# EAGLE design FubarinoMini_v20 (EAGLE 9.1.3)
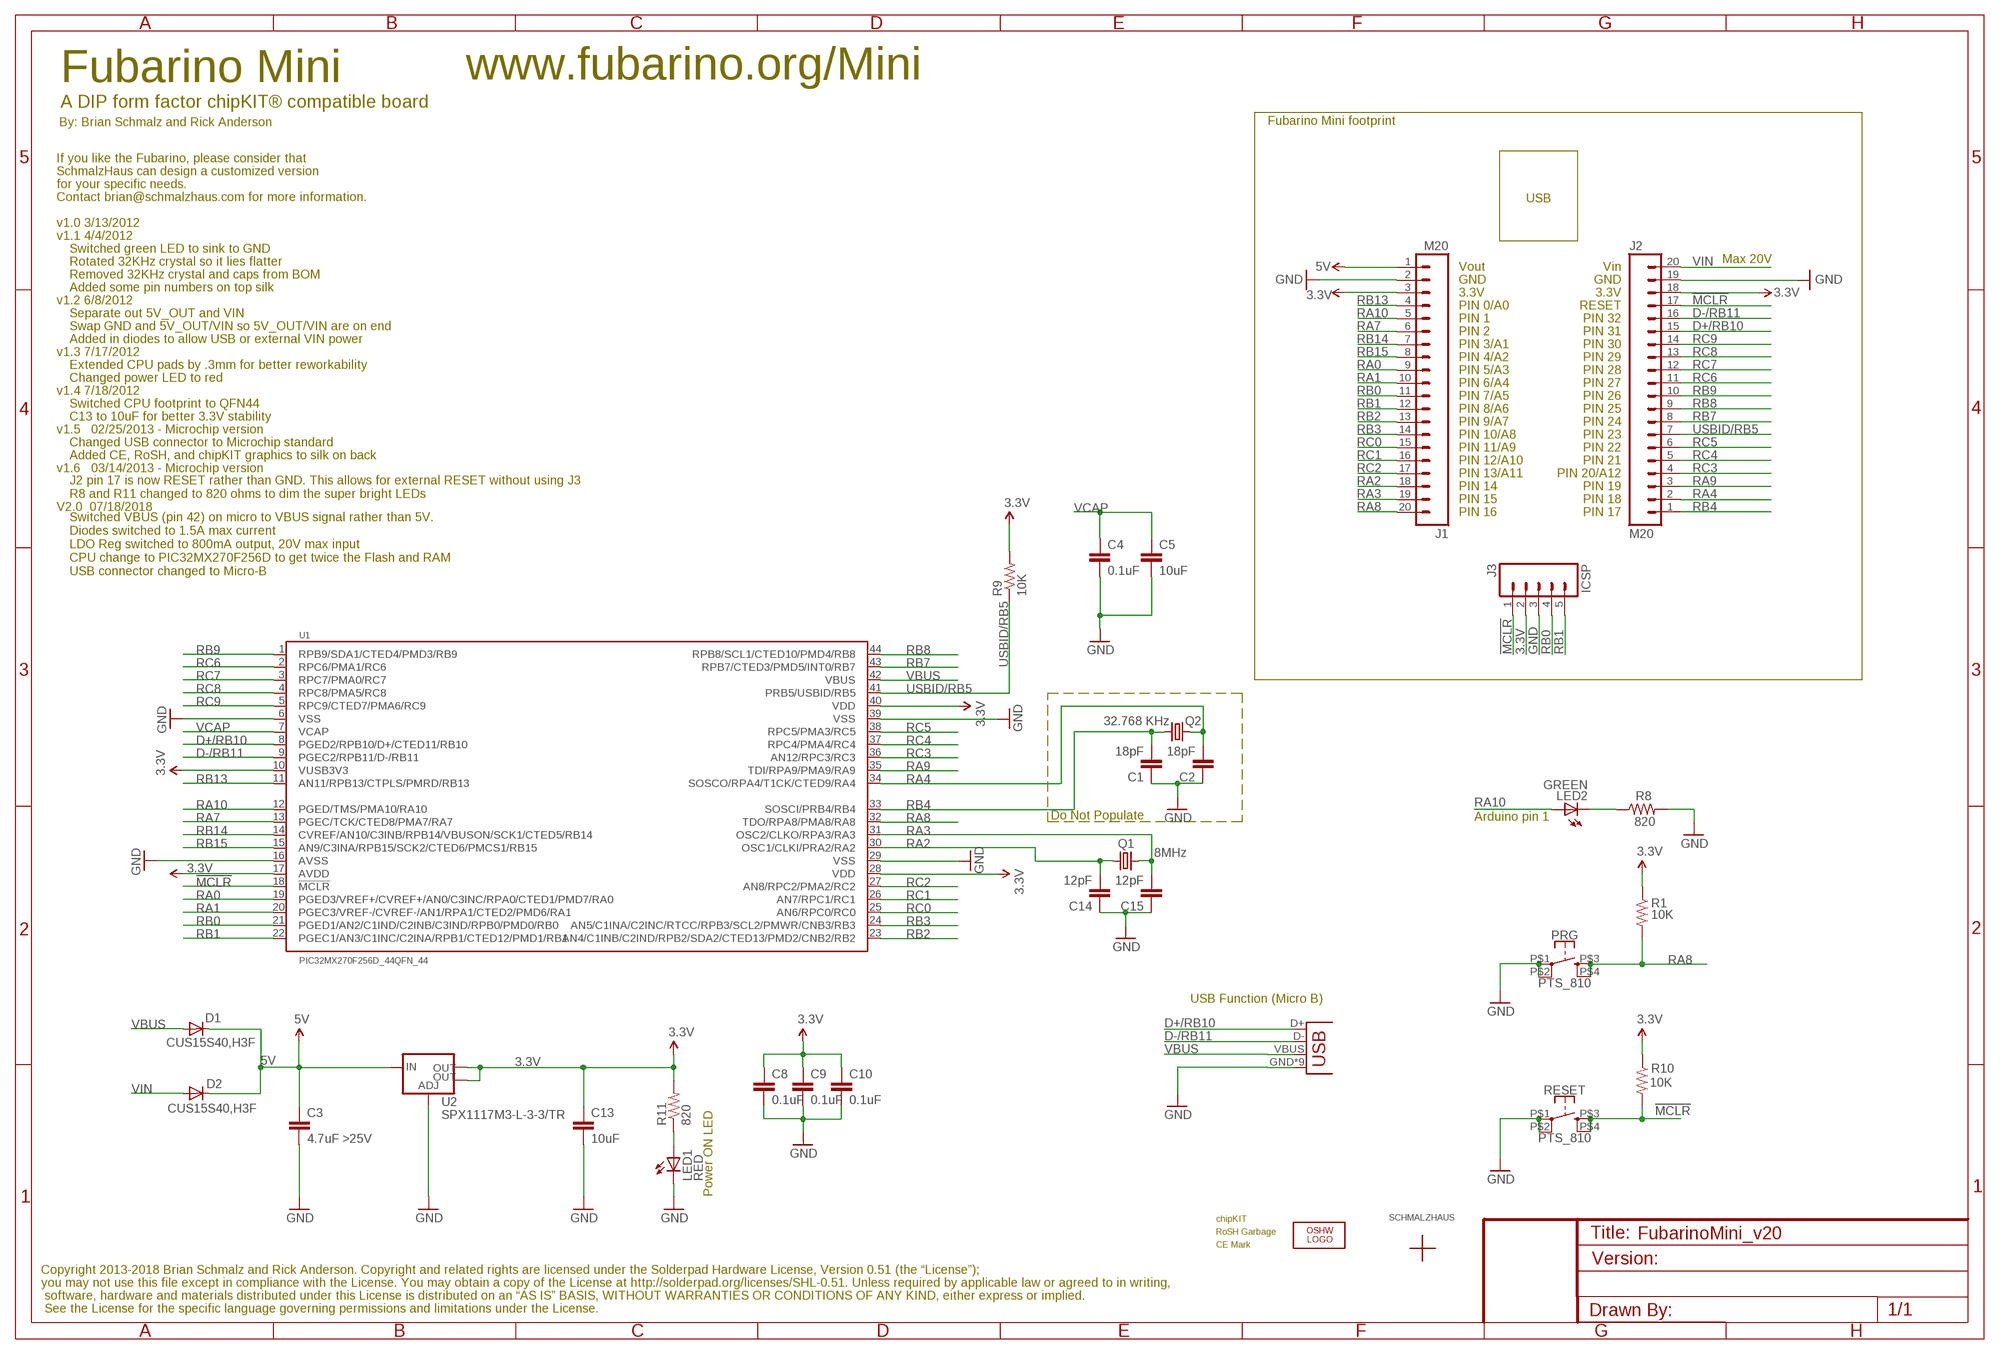
[diagram p0: schematic, sheet 1]

## Parts
C1  18pF  CAP0603-CAP  [0603-CAP]
C2  18pF  CAP0603-CAP  [0603-CAP]
C3  4.7uF >25V  CAP0603-CAP  [0603-CAP]
C4  0.1uF  CAP0603-CAP  [0603-CAP]
C5  10uF  CAP0805  [0805]
C8  0.1uF  CAP0603-CAP  [0603-CAP]
C9  0.1uF  CAP0603-CAP  [0603-CAP]
C10  0.1uF  CAP0603  [0603]
C13  10uF  CAP0805  [0805]
C14  12pF  CAP0603-CAP  [0603-CAP]
C15  12pF  CAP0603-CAP  [0603-CAP]
D1  CUS15S40,H3F  DIODESOD  [SOD-323]
D2  CUS15S40,H3F  DIODESOD  [SOD-323]
ICSP  J3  M05NOSLILK  [1X05_NOSILK]
J1  M20  [1X20_NO_PIN1]
J2  M20  [1X20_NO_PIN1]
LED1  RED  LED0603  [LED-0603]
LED2  GREEN  LED0603  [LED-0603]
LOGO1  OSHW_LOGO_8MILX0070-NT  [OSHW_8X70_NOTEXT]
PRG  PTS_810  [PTS_810]
Q1  8MHz  NX3225GD  [NX3225GD]
Q2  32.768 KHz  CRYSTALTC26H  [TC26H]
R1  10K  RESISTOR0603-RES  [0603-RES]
R8  820  RESISTOR0603-RES  [0603-RES]
R9  10K  RESISTOR0603-RES  [0603-RES]
R10  10K  RESISTOR0603-RES  [0603-RES]
R11  820  RESISTOR0603-RES  [0603-RES]
RESET  PTS_810  [PTS_810]
U1  PIC32MX270F256D_44QFN_44  PIC32MX2XX_44QFN44  [QFN-44-8X8-NOPAD]
U2  SPX1117M3-L-3-3/TR  V_REG_LM1117SOT223  [SOT223]
U$1  SCHMALZHAUSSCHMALZHAUS_SMALL  [SCHMALZHAUS_SMALL]
U$2  CE_MARK5MM  [CE_5MM]
U$3  ROSH_GARBAGE  [ROHS_GARBAGE_5MM]
U$4  CHIPKIT2MM  [CHIPKIT_2MM]
U$5  USBMICROB  [USB-MICROB_FCI_PINS]

## Nets
3.3V: C8.1 C9.1 C10.1 C13.1 ICSP.2 J1.3 J2.18 R1.1 R9.2 R10.1 R11.2 U1.10(VUSB3V3) U1.17(AVDD) U1.28(VDD) U1.40(VDD) U2.2(OUT) U2.4(OUT)
5V: C3.1 D1.1(C) D2.1(C) J1.1 U2.3(IN)
!MCLR!: ICSP.1 J2.17 R10.2 RESET.P$3 RESET.P$4 U1.18(!MCLR!)
D+/RB10: J2.15 U1.8(PGED2/RPB10/D+/CTED11/RB10) U$5.D+
D-/RB11: J2.16 U1.9(PGEC2/RPB11/D-/RB11) U$5.D-
GND: C1.1 C2.1 C3.2 C4.2 C5.2 C8.2 C9.2 C10.2 C13.2 C14.1 C15.1 ICSP.3 J1.2 J2.19 LED1.C PRG.P$1 PRG.P$2 R8.2 RESET.P$1 RESET.P$2 U1.6(VSS) U1.16(AVSS) U1.29(VSS) U1.39(VSS) U2.1(ADJ) U$5.GND U$5.GND@1(GND) U$5.GND@2(GND) U$5.GND@3(GND) U$5.GND@4(GND) U$5.GND@5(GND) U$5.GND@6(GND) U$5.GND@7(GND) U$5.GND@8(GND)
N$6: LED1.A R11.1
N$20: LED2.C R8.1
RA0: J1.9 U1.19(PGED3/VREF+/CVREF+/AN0/C3INC/RPA0/CTED1/PMD7/RA0)
RA1: J1.10 U1.20(PGEC3/VREF-/CVREF-/AN1/RPA1/CTED2/PMD6/RA1)
RA2: C14.2 J1.18 Q1.P$1 U1.30(OSC1/CLKI/PRA2/RA2)
RA3: C15.2 J1.19 Q1.P$2 U1.31(OSC2/CLKO/RPA3/RA3)
RA4: C2.2 J2.2 Q2.1 U1.34(SOSCO/RPA4/T1CK/CTED9/RA4)
RA7: J1.6 U1.13(PGEC/TCK/CTED8/PMA7/RA7)
RA8: J1.20 PRG.P$3 PRG.P$4 R1.2 U1.32(TDO/RPA8/PMA8/RA8)
RA9: J2.3 U1.35(TDI/RPA9/PMA9/RA9)
RA10: J1.5 LED2.A U1.12(PGED/TMS/PMA10/RA10)
RB0: ICSP.4 J1.11 U1.21(PGED1/AN2/C1IND/C2INB/C3IND/RPB0/PMD0/RB0)
RB1: ICSP.5 J1.12 U1.22(PGEC1/AN3/C1INC/C2INA/RPB1/CTED12/PMD1/RB1)
RB2: J1.13 U1.23(AN4/C1INB/C2IND/RPB2/SDA2/CTED13/PMD2/CNB2/RB2)
RB3: J1.14 U1.24(AN5/C1INA/C2INC/RTCC/RPB3/SCL2/PMWR/CNB3/RB3)
RB4: C1.2 J2.1 Q2.2 U1.33(SOSCI/PRB4/RB4)
RB7: J2.8 U1.43(RPB7/CTED3/PMD5/INT0/RB7)
RB8: J2.9 U1.44(RPB8/SCL1/CTED10/PMD4/RB8)
RB9: J2.10 U1.1(RPB9/SDA1/CTED4/PMD3/RB9)
RB13: J1.4 U1.11(AN11/RPB13/CTPLS/PMRD/RB13)
RB14: J1.7 U1.14(CVREF/AN10/C3INB/RPB14/VBUSON/SCK1/CTED5/RB14)
RB15: J1.8 U1.15(AN9/C3INA/RPB15/SCK2/CTED6/PMCS1/RB15)
RC0: J1.15 U1.25(AN6/RPC0/RC0)
RC1: J1.16 U1.26(AN7/RPC1/RC1)
RC2: J1.17 U1.27(AN8/RPC2/PMA2/RC2)
RC3: J2.4 U1.36(AN12/RPC3/RC3)
RC4: J2.5 U1.37(RPC4/PMA4/RC4)
RC5: J2.6 U1.38(RPC5/PMA3/RC5)
RC6: J2.11 U1.2(RPC6/PMA1/RC6)
RC7: J2.12 U1.3(RPC7/PMA0/RC7)
RC8: J2.13 U1.4(RPC8/PMA5/RC8)
RC9: J2.14 U1.5(RPC9/CTED7/PMA6/RC9)
USBID/RB5: J2.7 R9.1 U1.41(PRB5/USBID/RB5)
VBUS: D1.2(A) U1.42(VBUS) U$5.VBUS
VCAP: C4.1 C5.1 U1.7(VCAP)
VIN: D2.2(A) J2.20

## Notes on the sheet
- Fubarino Mini | www.fubarino.org/Mini
- A DIP form factor chipKIT® compatible board
- By: Brian Schmalz and Rick Anderson | Fubarino Mini footprint
- If you like the Fubarino, please consider that
- SchmalzHaus can design a customized version
- for your specific needs.
- Contact brian@schmalzhaus.com for more information. | USB
- v1.0 3/13/2012
- v1.1 4/4/2012
- Switched green LED to sink to GND
- Vin | Max 20V
- Rotated 32KHz crystal so it lies flatter
- Vout
- GND
- Removed 32KHz crystal and caps from BOM
- GND
- 3.3V
- Added some pin numbers on top silk
- 3.3V
- RESET
- v1.2 6/8/2012
- PIN 0/A0
- PIN 32
- Separate out 5V_OUT and VIN
- PIN 1
- PIN 31
- Swap GND and 5V_OUT/VIN so 5V_OUT/VIN are on end
- PIN 2
- PIN 30
- Added in diodes to allow USB or external VIN power
- PIN 3/A1
- PIN 29
- v1.3 7/17/2012
- PIN 4/A2
- PIN 28
- Extended CPU pads by .3mm for better reworkability
- PIN 5/A3
- PIN 27
- Changed power LED to red
- PIN 6/A4
- PIN 26
- v1.4 7/18/2012
- PIN 7/A5
- PIN 25
- Switched CPU footprint to QFN44
- PIN 8/A6
- PIN 24
- C13 to 10uF for better 3.3V stability
- PIN 9/A7
- PIN 23
- v1.5   02/25/2013 - Microchip version
- PIN 10/A8
- PIN 22
- Changed USB connector to Microchip standard
- PIN 11/A9
- PIN 21
- Added CE, RoSH, and chipKIT graphics to silk on back
- PIN 12/A10
- PIN 20/A12
- v1.6   03/14/2013 - Microchip version
- PIN 13/A11
- PIN 19
- PIN 14
- PIN 18
- J2 pin 17 is now RESET rather than GND. This allows for external RESET without using J3
  R8 and R11 changed to 820 ohms to dim the super bright LEDs
- PIN 15
- PIN 17
- V2.0  07/18/2018
- PIN 16
- Switched VBUS (pin 42) on micro to VBUS signal rather than 5V.
  Diodes switched to 1.5A max current
  LDO Reg switched to 800mA output, 20V max input
  CPU change to PIC32MX270F256D to get twice the Flash and RAM
  USB connector changed to Micro-B
- Do Not Populate
- Arduino pin 1
- USB Function (Micro B)
- Power ON LED
- Copyright 2013-2018 Brian Schmalz and Rick Anderson. Copyright and related rights are licensed under the Solderpad Hardware License, Version 0.51 (the “License”);
- you may not use this file except in compliance with the License. You may obtain a copy of the License at http://solderpad.org/licenses/SHL-0.51. Unless required by applicable law or agreed to in writing,
- software, hardware and materials distributed under this License is distributed on an “AS IS” BASIS, WITHOUT WARRANTIES OR CONDITIONS OF ANY KIND, either express or implied.
- See the License for the specific language governing permissions and limitations under the License.

## Library data of the parts
C1-C4 C8 C9 C14 C15 = SparkFun:CAP: Capacitor Standard 0603 ceramic capacitor, and 0.1" leaded capacitor.
C5 = SchmalzHaus:CAP: Capacitor Standard 0603 ceramic capacitor, and 0.1" leaded capacitor.
C10 C13 = SparkFun02-20-08:CAP: Capacitor Standard 0603 ceramic capacitor, and 0.1" leaded capacitor.
D1 D2 = SparkFun:DIODE: Diode These are standard reverse protection diodes and small signal diodes. SMA package can handle up to about 1A. SOD-323 can handle about 200mA. What the SOD-323 package when ordering, there are some mfgs out there that are 5-pin packages.
ICSP = SchmalzHaus:M05: Header 5 Standard 5-pin 0.1" header. Use with straight break away headers (SKU : PRT-00116), right angle break away headers (PRT-00553), swiss pins (PRT-00743), machine pins (PRT-00117), and female headers (PRT-00115). Molex polarized connector foot print use with SKU : PRT-08230 with associated crimp pins and housings.
J1 J2 = SchmalzHaus:M20
LED1 LED2 = SparkFun:LED: LEDs Standard schematic elements and footprints for 5mm, 3mm, 1206, and 0603 sized LEDs. 5mm - Spark Fun Electronics SKU : COM-00529 (and others)
LOGO1 = OSHW:OSHW_LOGO_8MIL
PRG RESET = CK_PTS_810_TactSwitch:PTS_810
Q1 = NDK_NX3225GD_Crystal:NX3225GD
Q2 = SchmalzHaus:CRYSTAL: Crystals Various standard crystals. Proven footprints. Spark Fun Electronics SKU : COM-00534
R1 R8-R11 = SparkFun:RESISTOR: Resistor Basic schematic elements and footprints for 0603, 1206, and PTH resistors.
U1 = SchmalzHaus:PIC32MX2XX_44
U2 = SparkFun-IC-Power:V_REG_LM1117: Voltage Regulator LM1117 Standard adjustable voltage regulator but in SMD form. Spark Fun Electronics SKU : COM-00595; PROD_ID: VREG-08170
U$1 = SchmalzHaus:SCHMALZHAUS
U$2 = SchmalzHausPublic:CE_MARK
U$3 = SchmalzHausPublic:ROSH_GARBAGE
U$4 = SchmalzHausPublic:CHIPKIT
U$5 = SchmalzHaus:USB: USB Connectors USB-B-PTH is fully proven SKU : PRT-00139 USB-miniB is fully proven SKU : PRT-00587 USB-A-PCB is untested. USB-A-H is throughly reviewed, but untested. Spark Fun Electronics SKU : PRT-00437 USB-B-SMT is throughly reviewed, but untested. Needs silkscreen touching up. USB-A-S has not been used/tested USB-MB-H has not been used/tested

## Board
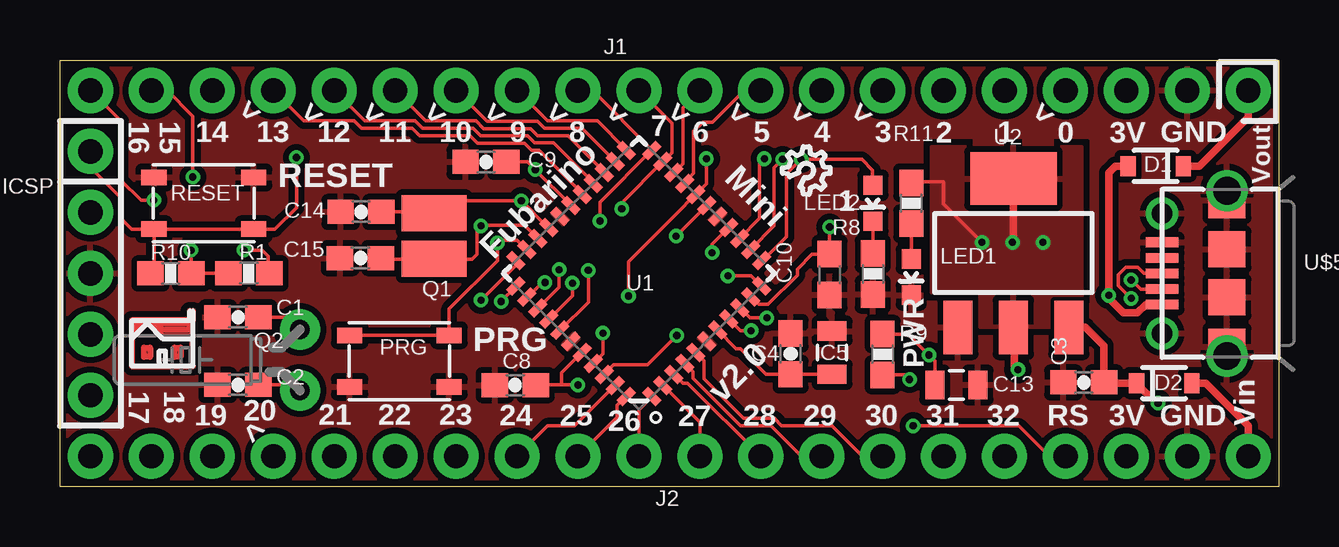
[diagram p1: board, top side]
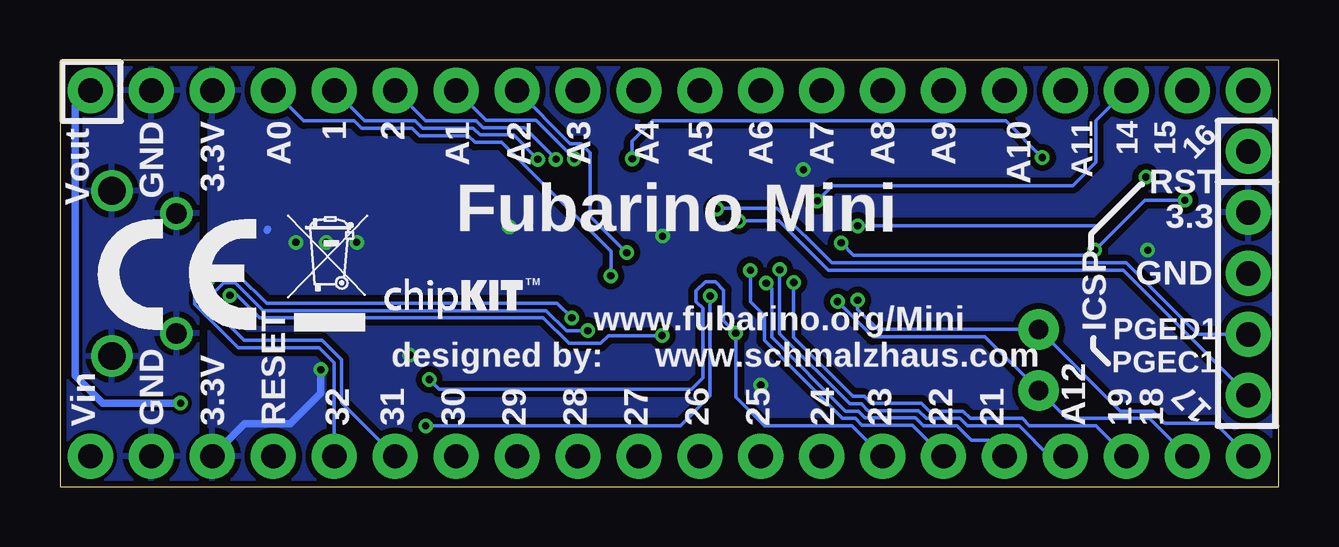
[diagram p2: board, bottom side, seen from below]

Size 50.8 x 17.78 mm. Coordinates in mm from the lower left corner, seen from the top.
Outline: 0,17.78 50.8,17.78 50.8,0 0,0 0,17.78
Copper layers (1*16): Top 0.035mm / dielectric 1.5mm / Bottom 0.035mm
Design rules "Fusion_eagle_rule_v1.1 *": minimum track width 6mil, minimum drill 0.0003mm, track to track 6mil, track to pad 6mil, pad to pad 6mil, via to via 6mil, smd to smd 0mil, copper to edge 10mil, drill to drill 10mil, minimum pad ring 10mil, minimum via ring 6mil, stop-mask expansion 2mil, vias tented up to drill 100mil, thermal gap 10mil

### Footprints (pad centres in the part's own frame; a part is rotated, then mirrored left to right if it is on the bottom)
0603-CAP = smd 1.1 x 1: 1 -0.85,0; 2 0.85,0
0805 = smd 0.8 x 1.2: 1 -0.9,0; 2 0.9,0
0603 = smd 1.1 x 1: 1 -0.85,0; 2 0.85,0
SOD-323 = smd 0.63 x 0.83: 1 -1.15,0; 2 1.15,0
1X05_NOSILK = drill 1.016 pad 1.88: 1 0,0; 2 2.54,0; 3 5.08,0; 4 7.62,0; 5 10.16,0
1X20_NO_PIN1 = drill 1.016 pad 1.88: 1 -24.13,0; 2 -21.59,0; 3 -19.05,0; 4 -16.51,0; 5 -13.97,0; 6 -11.43,0; 7 -8.89,0; 8 -6.35,0; 9 -3.81,0; 10 -1.27,0; 11 1.27,0; 12 3.81,0; 13 6.35,0; 14 8.89,0; 15 11.43,0; 16 13.97,0; 17 16.51,0; 18 19.05,0; 19 21.59,0; 20 24.13,0
LED-0603 = smd 0.8 x 0.8: A 0,-0.75; C 0,0.75
PTS_810 = smd 1.05 x 0.65: P$1 -2.075,1.075; P$2 2.075,1.075; P$3 -2.075,-1.075; P$4 2.075,-1.075
NX3225GD = smd 1.5 x 2.7: P$1 0.95,0; P$2 -0.95,0
TC26H = drill 0.813 pad 1.676: 1 -1.27,0; 2 1.27,0
0603-RES = smd 1.1 x 1: 1 -0.85,0; 2 0.85,0
QFN-44-8X8-NOPAD = smd 0.8 x 0.35: 1 -4,3.25; 2 -4,2.6; 3 -4,1.95; 4 -4,1.3; 5 -4,0.65; 6 -4,0; 7 -4,-0.65; 8 -4,-1.3; 9 -4,-1.95; 10 -4,-2.6; 11 -4,-3.25; 23 4,-3.25; 24 4,-2.6; 25 4,-1.95; 26 4,-1.3; 27 4,-0.65; 28 4,0; 29 4,0.65; 30 4,1.3; 31 4,1.95; 32 4,2.6; 33 4,3.25 | smd 0.35 x 0.8: 12 -3.25,-4; 13 -2.6,-4; 14 -1.95,-4; 15 -1.3,-4; 16 -0.65,-4; 17 0,-4; 18 0.65,-4; 19 1.3,-4; 20 1.95,-4; 21 2.6,-4; 22 3.25,-4; 34 3.25,4; 35 2.6,4; 36 1.95,4; 37 1.3,4; 38 0.65,4; 39 0,4; 40 -0.65,4; 41 -1.3,4; 42 -1.95,4; 43 -2.6,4; 44 -3.25,4
SOT223 = smd 1.219 x 2.235: 1 -2.311,-3.099; 2 0,-3.099; 3 2.311,-3.099 | smd 3.6 x 2.2: 4 0,3.099
USB-MICROB_FCI_PINS = smd 0.4 x 1.35: D+ 0,2.7; D- -0.65,2.7; GND 1.3,2.7; ID 0.65,2.7; VBUS -1.3,2.7 | drill 1.15: GND@1 -3.445,0; GND@2 3.445,0 | drill 0.85: GND@3 -2.5,2.7; GND@4 2.5,2.7 | smd 1.5 x 1.55: GND@5 -3.05,0; GND@6 -1,0; GND@7 1,0; GND@8 3.05,0

### Placement (x,y rotation side)
C1  7.42,7.06 0 top
C2  7.42,4.24 0 top
C3  42.67,4.34 180 top
C4  30.45,5.54 90 top
C5  32.18,5.59 90 top
C8  18.98,4.23 180 top
C9  17.75,13.54 180 top
C10  32.08,8.84 270 top
C13  37.36,4.24 0 top
C14  12.55,11.46 0 top
C15  12.52,9.53 0 top
D1  45.67,13.36 180 top
D2  46.02,4.32 0 top
DRILEGEND  [DRILEGEND]  101.19,28.7 0 top  (outside the outline)
ICSP  1.27,13.97 270 top
J1  25.4,16.51 180 top
J2  25.4,1.27 0 top
LED1  35.48,8.74 180 top
LED2  33.88,11.81 180 top
LOGO1  29.86,13.32 315 top
PRG  14.15,5.23 180 top
Q1  15.6,10.44 90 top
Q2  10.01,5.28 90 top
R1  7.87,8.89 0 top
R8  33.88,8.86 270 top
R9  34.29,5.51 90 top
R10  4.62,8.89 180 top
R11  35.48,11.81 90 top
RESET  5.99,11.81 0 top
U1  24.13,8.89 135 top
U2  39.74,9.74 0 top
U$1  4.27,5.03 0 top
U$2  45.9,8.9 0 bottom
U$3  41.3,6.49 0 bottom
U$4  37.39,6.94 0 bottom
U$5  48.64,8.89 90 top

### Tracks (layer width: path | path; a pad name or v marks a point on that pad's centre or on a via)
3.3V  (via drill 0.3)
  Top 0.152: R1.1 R10.1 5.47,9.84 v5.46,9.86 | C9.1 19.48,13.54 v19.81,13.21 U1.28 | U1.10 28.83,7.9 29.13,7.59 29.52,7.59 30.73,8.81 30.73,9.07 31.34,9.68 32.07,9.68 C10.1 v32.08,10.82 | U1.17 v25.68,10.44 | v38.43,10.19 36.83,11.79 36.83,12.7 35.52,12.7 R11.2 | C8.1 19.84,4.24 20.9,4.24 | 20.9,4.24 v21.59,4.24 | U1.40 20.9,4.75 20.9,4.24 | R9.2 35.34,6.36 36.21,5.5 v36.22,5.49 36.46,5.24 C13.1
  Top 0.305: U2.2 39.78,6.61 39.78,4.98 39.88,4.88 v39.93,4.88 | U2.4 39.74,10.17 39.75,10.16 39.73,10.19 v39.7,10.19
  Bottom 0.305: 42.16,10.69 42.14,10.72 | v39.93,4.88 39.93,3.89 41.2,2.62 43.1,2.62 J2.18
  other vias: 40.97,10.19
  pour Top: 36.47,14.17 42.6,14.17 42.6,6.65 38.35,6.65 38.35,8.08 36.32,8.08 36.32,14.17
  pour Bottom (isolate 0.254, rank 3): 0,0 0,17.78 44.58,17.78 44.58,0
5V  (via drill 0.3)
  Top 0.305: D1.1 47.5,13.36 49.53,15.39 J1.1 | v45.77,3.48 45.71,3.48 D2.1 43.55,4.32 C3.1 43.51,4.36 43.51,5.87 42.74,6.64 U2.3
  Bottom 0.305: J1.1 50.16,15.88 50.16,4.62 49.02,3.48 v45.77,3.48
!MCLR!  (via drill 0.3)
  Top 0.152: ICSP.1 1.27,13.31 2.54,12.04 2.54,11.18 3,10.72 3.9,10.72 RESET.P$3 | v23.7,7.95 23.7,9.37 25.65,11.33 U1.18 26.95,12.63 v26.95,13.66 | v35.56,2.54 39.97,2.54 41.25,1.26 41.25,1.27 J2.17 | R10.2 3.92,9.04 RESET.P$3 | RESET.P$3 RESET.P$4 8.96,10.74 9.86,11.63 v9.86,13.72
  Bottom 0.152: v9.86,13.72 11.38,15.24 26.11,15.24 26.95,14.4 v26.95,13.66 | v23.7,7.95 23.7,3.79 24.94,2.54 32.77,2.54 v35.56,2.54
D+/RB10  (via drill 0.3)
  Top 0.152: v28.8,6.5 28.37,6.5 27.89,6.98 U1.8 | v44.65,7.85 44.63,7.85 44.11,8.37 44.11,8.84 44.42,9.15 44.92,9.15 45.18,8.89 U$5.D+
  Bottom 0.152: v44.65,7.85 44.64,7.84 44.63,7.85 | v28.8,6.5 29.69,6.5 30.53,7.34 42.33,7.34 43.49,8.51 43.97,8.51 44.63,7.85 | J2.15 39.06,3.5 39.06,5.29 39.87,6.1 43.12,6.1 44.62,7.6 44.62,7.85 44.63,7.85
D-/RB11  (via drill 0.3)
  Top 0.152: U1.9 28.75,7.04 29.11,7.04 v29.46,7.04 | U$5.D- 45.05,8.24 44.67,8.62 v44.64,8.62
  Bottom 0.152: J2.16 39.37,5.17 39.99,5.79 43.13,5.79 43.37,5.79 45.18,7.6 45.18,8.11 44.67,8.62 v44.64,8.62 44.44,8.82 43.36,8.82 42.19,7.64 30.07,7.64 v29.46,7.04
GND
  pour Top (isolate 0.254, rank 6): 0,17.78 0,0 50.8,0 50.8,17.78
  pour Bottom: 50.8,17.78 50.8,0 45.06,0 45.06,17.78
N$6
  Top 0.152: R11.1 LED1.A
N$20
  Top 0.152: LED2.C R8.1
RA0
  Top 0.152: U1.19 26.04,12.68 26.42,13.06 26.42,14.81 26.8,15.19 27.2,15.19 28.53,16.51 J1.9
RA1
  Top 0.152: U1.20 25.59,13.1 25.96,13.46 25.96,15.8 J1.10
RA2  (via drill 0.3)
  Top 0.152: U1.30 20.33,10.81 19.25,11.89 v19.23,11.91 16.12,11.91 Q1.P$1 15.53,11.46 C14.2
  Bottom 0.152: J1.18 7.62,15.24 7.62,13.51 8.59,12.55 11.8,12.55 18.59,12.55 v19.23,11.91
RA3  (via drill 0.3)
  Top 0.152: v5.54,12.9 5.54,15.44 4.47,16.51 J1.19 | U1.31 19.37,10.89 18.87,10.89 | v17.55,10.87 17.57,10.89 18.87,10.89 | C15.2 13.42,9.47 15.58,9.47 Q1.P$2 15.61,9.47 17.17,9.47 17.38,9.68 17.38,10.69 17.59,10.89 18.8,10.89 18.87,10.89
  Bottom 0.152: v17.55,10.87 7.57,10.87 v5.54,12.9
RA4  (via drill 0.3)
  Top 0.152: C2.2 9.78,4.24 Q2.1 | U1.34 19,8.34 v18.39,7.72
  Bottom 0.152: J2.2 5.38,2.85 8.84,2.85 Q2.1 12.24,6.25 16.92,6.25 v18.39,7.72
RA7  (via drill 0.3)
  Top 0.152: U1.13 28.8,9.9 29.77,10.87 29.77,13.28 v30.12,13.64
  Bottom 0.152: v30.12,13.64 31.45,14.96 33.17,14.96 33.45,15.24 35.56,15.24 J1.6
RA8  (via drill 0.3)
  Top 0.152: J1.20 2.54,15.24 2.54,12.78 3.38,11.94 v3.91,11.94 | v7.67,9.86 8.43,9.86 8.69,9.6 8.69,8.93 R1.2 | U1.32 19.43,9.88 19.05,10.26 18.34,10.26 v18.24,10.16 18.24,9.42 16.22,7.41 PRG.P$3 PRG.P$4
  Bottom 0.152: v3.91,11.94 5.59,11.94 v7.67,9.86 7.87,9.65 17.73,9.65 v18.24,10.16
RA9  (via drill 0.3)
  Top 0.152: U1.35 19.48,7.9 20.09,8.51 v20.22,8.51
  Bottom 0.152: J2.3 7.62,2.54 10.39,2.54 10.69,2.85 12.85,2.85 13.16,3.15 14.56,3.15 14.89,3.48 17,3.48 17.27,3.76 17.75,3.76 20.22,6.22 v20.22,8.51
RA10  (via drill 0.3)
  Top 0.152: U1.12 29.28,9.42 30.28,10.41 30.28,13.03 v30.89,13.64 33.43,13.64 33.87,13.2 33.87,12.57 LED2.A
  Bottom 0.152: J1.5 38.1,15.24 35.99,15.24 35.69,14.94 33.58,14.94 33.3,14.66 31.9,14.66 v30.89,13.64
RB0  (via drill 0.3)
  Top 0.152: J1.11 25.5,15.14 25.5,13.92 25.14,13.56 U1.21 25.12,13.54 23.42,11.84 v23.42,11.58
  Bottom 0.152: v23.42,11.58 23.39,11.61 20.9,11.61 18.62,9.32 6.35,9.32 3.38,6.35 ICSP.4
RB1  (via drill 0.3)
  Top 0.152: J1.12 22.2,16.51 24.66,14.05 U1.22 22.5,11.86 v22.5,11.07
  Bottom 0.152: ICSP.5 6.48,9.02 18.77,9.02 20.83,11.07 v22.5,11.07
RB2
  Top 0.152: U1.23 23.6,14.04 22.4,15.24 20.32,15.24 J1.13
RB3
  Top 0.152: U1.24 21.76,14.94 20.19,14.94 19.9,15.23 17.79,15.23 J1.14
RB4  (via drill 0.3)
  Top 0.152: C1.2 9.5,7.06 Q2.2 | v17.55,7.77 19,9.22 U1.33
  Bottom 0.152: J2.1 2.64,2.64 4.75,2.64 5.26,3.15 6.6,3.15 Q2.2 16.71,6.55 17.55,7.39 v17.55,7.77
RB7
  Top 0.152: U1.43 23.14,4.19 23.09,4.19 21.44,2.54 20.32,2.54 J2.8
RB8
  Top 0.152: J2.9 23.22,2.9 23.22,3.4 23.49,3.68 23.6,3.68 U1.44
RB9
  Top 0.152: U1.1 24.68,3.76 24.68,3.75 24.13,3.2 J2.10
RB13  (via drill 0.3)
  Top 0.152: U1.11 29.23,8.36 28.8,8.79 v27.84,8.79
  Bottom 0.152: J1.4 40.64,15.24 38.53,15.24 38.23,14.94 36.12,14.94 35.81,14.63 33.78,14.63 33.5,14.35 32.38,14.35 27.84,9.8 v27.84,8.79
RB14  (via drill 0.3)
  Top 0.152: U1.14 28.34,10.35 29.16,11.18 29.16,13.46 v29.36,13.66
  Bottom 0.152: v29.36,13.66 30.96,15.27 33.05,15.27 J1.7
RB15  (via drill 0.3)
  Top 0.152: v27.18,9.75 27.18,10.11 27.48,10.41 27.49,10.41 U1.15
  Bottom 0.152: v27.18,9.75 28.7,11.28 28.7,13.92 29.08,14.3 29.54,14.3 J1.8
RC0
  Top 0.152: J1.15 15.24,15.24 17.35,15.24 17.67,14.92 19.62,14.92 19.91,14.63 21.18,14.63 22.68,13.13 U1.25
RC1
  Top 0.152: J1.16 12.7,15.24 14.81,15.24 15.11,14.94 17.22,14.94 17.54,14.62 19.5,14.62 19.79,14.33 20.57,14.33 22.22,12.68 U1.26
RC2
  Top 0.152: J1.17 10.16,15.24 12.27,15.24 12.57,14.94 14.68,14.94 14.99,14.63 17.1,14.63 17.41,14.31 19.37,14.31 19.66,14.02 19.96,14.02 | U1.27 21.76,12.22 20.17,13.82 | 20.17,13.82 19.96,14.02 | 20.17,13.82 19.96,14.02
RC3  (via drill 0.3)
  Top 0.152: v20.8,9.04 20.8,8.31 19.94,7.44 U1.36
  Bottom 0.152: J2.4 9.55,1.27 10.82,2.54 12.98,2.54 13.28,2.85 14.68,2.85 15.01,3.17 17.12,3.17 17.4,3.45 17.88,3.45 20.8,6.38 v20.8,9.04
RC4  (via drill 0.3)
  Top 0.152: U1.37 20.39,6.98 21.36,7.95 v21.36,8.48
  Bottom 0.152: J2.5 12.09,1.93 12.8,1.93 13.41,2.54 13.97,2.54 14.81,2.54 15.14,2.87 17.25,2.87 17.53,3.15 18.06,3.15 21.13,6.22 21.13,8.26 v21.36,8.48
RC5  (via drill 0.3)
  Top 0.152: U1.38 22.02,7.7 v22.02,9.02
  Bottom 0.152: J2.6 15.27,2.56 17.37,2.56 17.65,2.85 18.19,2.85 21.44,6.1 21.44,7.12 22.02,7.71 v22.02,9.02
RC6
  Top 0.152: U1.2 25.14,4.22 26.67,2.69 J2.11
RC7
  Top 0.152: U1.3 25.59,4.68 25.96,4.32 26.16,4.32 J2.12
RC8
  Top 0.152: U1.4 26.39,4.8 26.39,4.52 28.37,2.54 29.63,2.54 30.9,1.27 J2.13
RC9
  Top 0.152: U1.5 26.85,5.26 26.85,4.5 28.5,2.85 29.78,2.85 30.08,2.54 32.17,2.54 33.44,1.27 J2.14
USBID/RB5  (via drill 0.3)
  Top 0.152: v22.63,6.4 22.63,5.55 U1.41 | v35.41,4.47 35.22,4.66 R9.1
  Bottom 0.152: J2.7 17.78,2.54 21.44,2.54 22.63,3.73 v22.63,6.4 23.14,6.91 23.14,8.2 23.48,8.53 23.9,8.53 24.28,8.16 24.28,7.71 24,7.43 24,4.55 24.49,4.06 35,4.06 v35.41,4.47
VBUS  (via drill 0.3)
  Top 0.152: U1.42 22.68,4.7 23.06,5.08 24.49,5.08 v25.7,6.3
  Top 0.305: D1.2 43.99,13.36 43.71,13.08 v43.71,7.98 43.71,7.85 44.32,7.24 44.91,7.24 45.26,7.59 U$5.VBUS
  Bottom 0.152: v25.7,6.3 27.94,6.3 28.27,5.97 29.59,5.97 30.66,7.04 42.47,7.04 43.41,7.98 v43.71,7.98
VCAP
  Top 0.152: U1.7 28.18,5.75 28.36,5.75 29.43,4.69 C4.1 C5.1
VIN
  Top 0.305: D2.2 47.75,4.32 49.53,2.54 J2.20

### Text on the board
tPlace: ^ | ^ | ^ | ^ | ^ | ^ | ^ | ^ | ^ | ^ | ^ | ^ | 16 | 15 | 7 | 14 | 13 | 12 | 12 | 11 | 10 | 9 | 8 | 6 | 5 | 4 | 3 | 2 | 1 | 0 | 3V | GND | Mini | Vout | RESET | 1 | Fubarino | PRG | PWR | 17 | 18 | 19 | 20 | 21 | 22 | 23 | 24 | 25 | 27 | v2.0 | 28 | 29 | 30 | 31 | 32 | RS | 3V | GND | Vin | ^ | 26
bPlace: 16 | 15 | 14 | A11 | A10 | A9 | A8 | A7 | A6 | A5 | A4 | A3 | A2 | A1 | 2 | 1 | A0 | 3.3V | GND | Vout | RST | 3.3 | Fubarino Mini | ICSP | GND | PGED1 | www.fubarino.org/Mini | PGEC1 | www.schmalzhaus.com | designed by: | 17 | 18 | 19 | A12 | 21 | 22 | 23 | 24 | 25 | 26 | 27 | 28 | 29 | 30 | 31 | 32 | RESET | 3.3V | GND | Vin
tDocu: ASSEMBLY NOTES: UNLESS OTHERWISE SPECIFIED / 1. ALL COMONENTS ARE RoHS COMPLIANT. / 2. ALL THROUGH HOLE COMPONENTS MOUNTED ON THE TOP SIDE / 3. ALL COMPONENTS AHLL BE MOUNTED FLUSH TO THE BOARD / 4. ALL UNUSED COMPONENTS PADS SHALL BE FREE OF SOLDER / 5. ALL LEADS SHALL BE TRIMMED TO A MAXIMUM LENGTH OF : N/A / 6. MAXIMUM COMPONENT HEIGHT NOT TO EXEED: N/A / 7. THESE COMPONENTS REQUIRE SOCKETS: NONE. / 8. UNPOPULATED COMPONENTS: SEE BILL OF MATERIALS / 9. FINISHED BOARD SHALL BE FREE FO ALL RESIDUES | TITLE: FUBARINO MINI / VERSION: 2.0 / DATE: 7/18/2018 / PCB DESIGNER: BRIAN SCHMALZ / brian@schmalzhaus.com / ENGINEER: BRIAN SCHMALZ
tMap: Copyright 2012-2018 Brian Schmalz Copyright and related rights are licensed under the Solderpad Hardware License, Version 0.51 (the “License”); | you may not use this file except in compliance with the License. You may obtain a copy of the License at http://solderpad.org/licenses/SHL-0.51. Unless required by applicable law or agreed to in writing, | software, hardware and materials distributed under this License is distributed on an “AS IS” BASIS, WITHOUT WARRANTIES OR CONDITIONS OF ANY KIND, either express or implied. | See the License for the specific language governing permissions and limitations under the License.
DrillLegend: LAYER-STACK
DrillLegend_01-16: 01-16
DrillLegend_01-20: 01-20
Contour: Notes: / This PCB to be manufactued to meet all acceptance levels / of a CLASS 2 PCB per ANSI/IPC-A-600G. / Material: Isola PCL370HR FR-4 or equivalent. / Multilayer / 2 Layers / Controlled Impedance / Cu weight external layers : 1oz / Cu weight internal layers : / Finished overall thickenss : 0.062 / Finish: / X Immersion Gold / Immersion Tin / Soldermask over bare copper (SMOBC) with / Hot-Air-Leveled-Solder / If edge connector fingers are present, plate / with Nicel/Gold >= 20 microinches Gold / / Soldermask: Dynachem EPIC 200 LPI or equivalent. / Soldermask Color: Green / Silkscreen Color: White / / Artwork Set No. 04-10134 Rev 2.0 / / All holes to be located by the NC Drill File. / Indicate Country where PCB was fabricated on the / side indicated. / Any devication from the above specs must be approved / by Schmalz Haus LLC.